# EAGLE design RH028.1 (EAGLE 7.1.0)
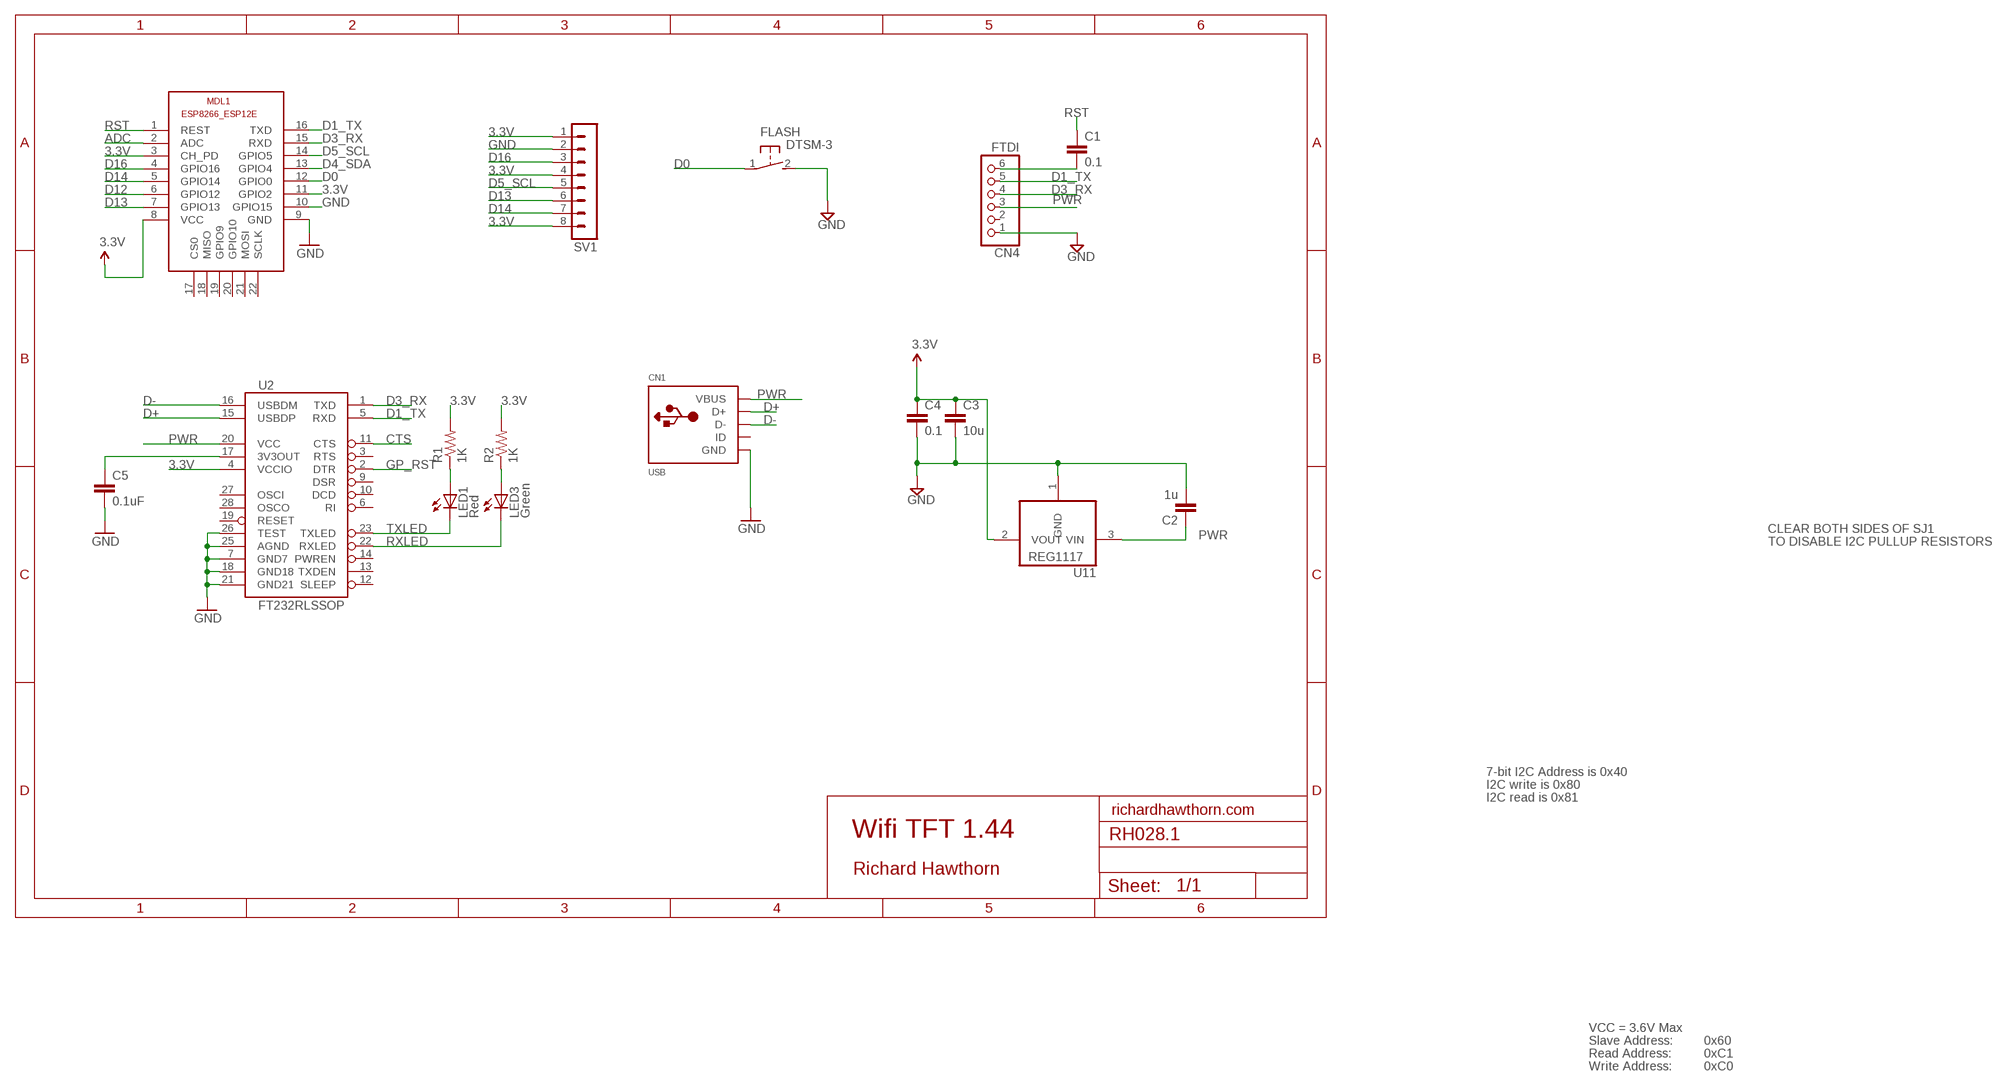
[diagram p0: schematic, sheet 1]

## Parts
C1  0.1  CAP0603-CAP  [0603-CAP]
C2  1u  CAP0603-CAP  [0603-CAP]
C3  10u  CAP0805-CAP  [0805-CAP]
C4  0.1  CAP0603-CAP  [0603-CAP]
C5  0.1uF  CAP0402-CAP  [0402-CAP]
CN1  USB  USBMINIB  [USB-MINIB]
CN4  FTDI  PINHD-1X6  [1X06]
FLASH  DTSM-3  [DTSM-3]
LED1  Red  LED0603  [LED-0603]
LED3  Green  LED0603  [LED-0603]
MDL1  ESP8266-12EESP8266-ESP12E  [ESP8266-ESP12E]
R1  1K  RESISTOR0402-RES  [0402-RES]
R2  1K  RESISTOR0402-RES  [0402-RES]
SV1  MA08-1  [MA08-1]
U2  FT232RLSSOP  [SSOP28DB]
U11  REG1117  [SOT223]

## Nets
3.3V: C3.1 C4.1 MDL1.3(CH_PD) MDL1.8(VCC) MDL1.11(GPIO2) R1.2 R2.2 SV1.1 SV1.4 SV1.8 U2.4(VCCIO) U11.2(VOUT)
3.3VOUT: C5.1 U2.17(3V3OUT)
ADC: MDL1.2(ADC)
CTS: U2.11(CTS)
D0: FLASH.1 MDL1.12(GPIO0)
D1_TX: CN4.5 MDL1.16(TXD) U2.5(RXD)
D3_RX: CN4.4 MDL1.15(RXD) U2.1(TXD)
D4_SDA: MDL1.13(GPIO4)
D5_SCL: MDL1.14(GPIO5) SV1.5
D12: MDL1.6(GPIO12)
D13: MDL1.7(GPIO13) SV1.6
D14: MDL1.5(GPIO14) SV1.7
D16: MDL1.4(GPIO16) SV1.3
D+: CN1.D+ U2.15(USBDP)
D-: CN1.D- U2.16(USBDM)
GND [power]: C2.2 C3.2 C4.2 C5.2 CN1.GND CN4.1 FLASH.2 MDL1.9(GND) MDL1.10(GPIO15) SV1.2 U2.7(GND7) U2.18(GND18) U2.21(GND21) U2.25(AGND) U2.26(TEST) U11.1(GND)
GP_RST: U2.2(DTR)
N$2: LED1.A R1.1
N$3: LED3.A R2.1
N$20: C1.2 CN4.6
PWR [power]: C2.1 CN1.VBUS CN4.3 U2.20(VCC) U11.3(VIN)
RST: C1.1 MDL1.1(REST)
RXLED: LED3.C U2.22(RXLED)
TXLED: LED1.C U2.23(TXLED)
Unconnected: CN1.ID CN4.2 MDL1.17(CS0) MDL1.18(MISO) MDL1.19(GPIO9) MDL1.20(GPIO10) MDL1.21(MOSI) MDL1.22(SCLK) U2.3(RTS) U2.6(RI) U2.9(DSR) U2.10(DCD) U2.12(SLEEP) U2.13(TXDEN) U2.14(PWREN) U2.19(RESET) U2.27(OSCI) U2.28(OSCO)

## Notes on the sheet
- CLEAR BOTH SIDES OF SJ1
- TO DISABLE I2C PULLUP RESISTORS
- 7-bit I2C Address is 0x40
- I2C write is 0x80
- I2C read is 0x81
- richardhawthorn.com
- Wifi TFT 1.44
- Richard Hawthorn
- VCC = 3.6V Max
- Slave Address: | 0x60
- Read Address: | 0xC1
- Write Address: | 0xC0

## Library data of the parts
C1-C4 = LowPowerLab:CAP: Capacitor Standard 0603 ceramic capacitor, and 0.1" leaded capacitor.
C5 = SparkFun:CAP: Capacitor Standard 0603 ceramic capacitor, and 0.1" leaded capacitor.
CN1 = LowPowerLab:USB: USB Connectors USBMINIB - Surface Mount Female Mini-B USB Connector 4UConnector: 06564 By microbuilder.eu Thru-hole RA Female Mini-B USB Connector 4UConnector: 18732 By ladyada.net
CN4 = pinhead:PINHD-1X6: PIN HEADER
FLASH = switch-tact:DTSM-3
LED1 LED3 = SparkFun:LED: LEDs Standard schematic elements and footprints for 5mm, 3mm, 1206, and 0603 sized LEDs. 5mm - Spark Fun Electronics SKU : COM-00529 (and others)
MDL1 = ESP8266-ESP12E:ESP8266-12E: ESP8266-12E with additional I/O and GPIO04/05 corrected The author cannot warrant that this library is free from error or will meet your specific requirements. Created by PuceBaboon.com. Komagane, Nagano, JAPAN
R1 R2 = SparkFun:RESISTOR: Resistor Basic schematic elements and footprints for 0603, 1206, and PTH resistors.
SV1 = con-lstb:MA08-1: PIN HEADER; OC_FARNELL: unknown; OC_NEWARK: unknown
U2 = SparkFun:FT232RL: USB UART FT232RL 4th Generation USB UART (USB <-> Serial) Controller. Spark Fun Electronics SKU : COM-00650
U11 = burr-brown:REG1117: 800mA and 1A Low Dropout (LDO) Positive Regulator 1.8V, 2.5V, 2.85V, 3.3V, 5V, and Adj; MPN: REG1117; OC_FARNELL: 1097566; OC_NEWARK: 14P6981

## Net classes
1 power: width 0.381 mm, clearance 0.254 mm

## Board
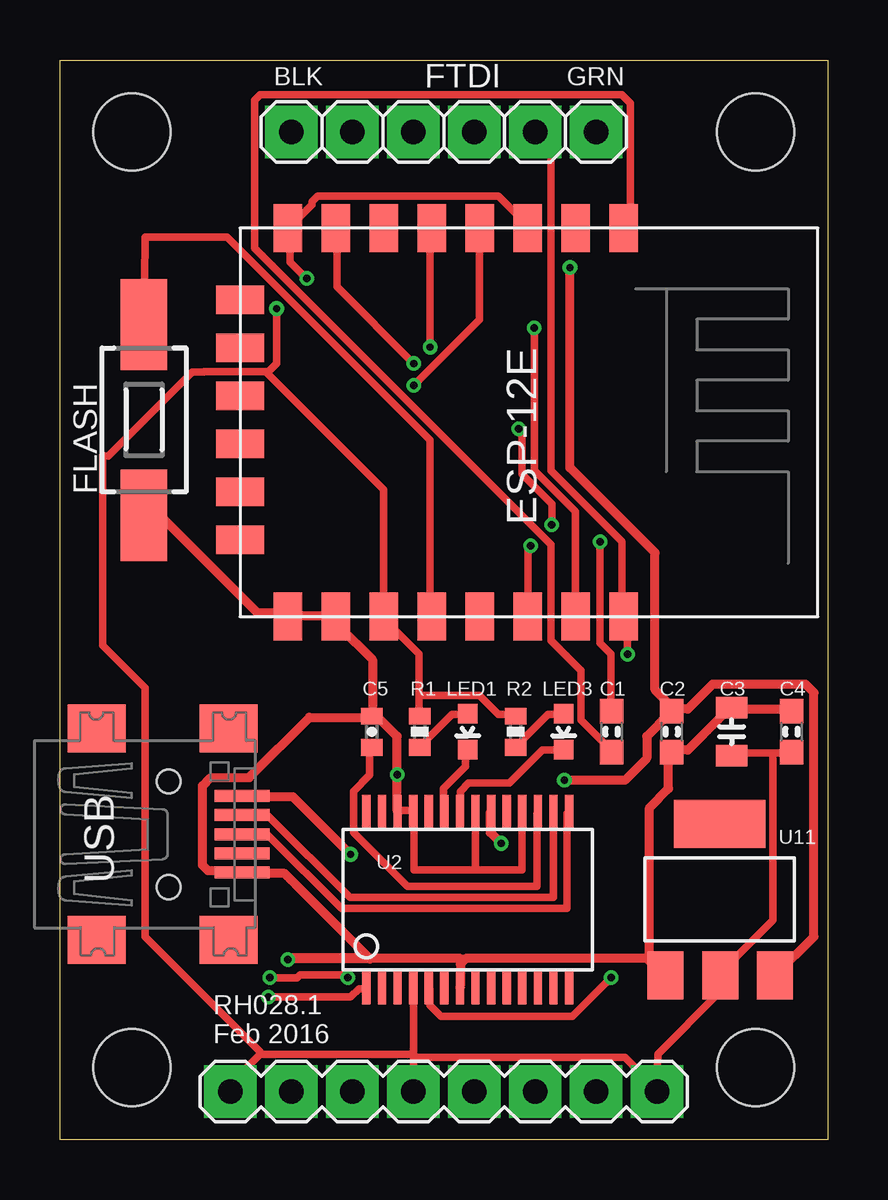
[diagram p1: board, top side]
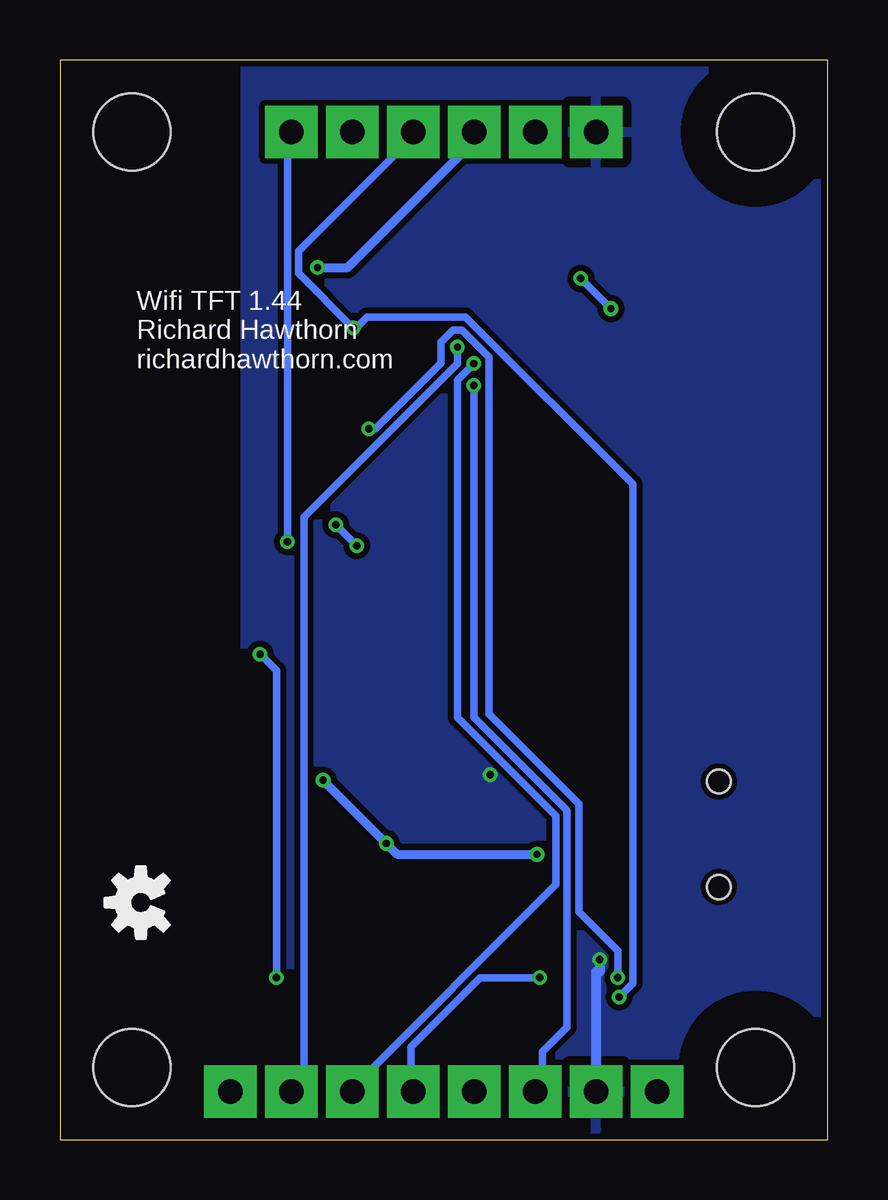
[diagram p2: board, bottom side, seen from below]

Size 32 x 45 mm. Coordinates in mm from the lower left corner, seen from the top.
Outline: 0,0 0,45 32,45 32,0 0,0
Copper layers (1*16): Top 0.035mm / dielectric 1.5mm / Bottom 0.035mm
Design rules "ITEADstudio_DRC *": minimum track width 12mil, minimum drill 12mil, track to track 6mil, track to pad 6mil, pad to pad 6mil, via to via 6mil, smd to smd 0mil, copper to edge 10mil, drill to drill 10mil, minimum pad ring 10mil, minimum via ring 6mil, stop-mask expansion 2mil, vias tented up to drill 100mil, thermal gap 15mil
Holes 3.2 mm at 3,3 29,3 3,42 29,42
tRestrict: area 24.5,19.5 to 32,45
bRestrict: area 24.5,19.5 to 32,45; area 0,0 to 6,6; area 26,0 to 32,6; area 0.1,39.1 to 5.9,44.9

### Footprints (pad centres in the part's own frame; a part is rotated, then mirrored left to right if it is on the bottom)
0603-CAP = smd 1.016 x 0.965: 1 -0.85,0; 2 0.85,0
0805-CAP = smd 0.902 x 1.3: 1 -1,0; 2 1,0
0402-CAP = smd 0.7 x 0.9: 1 -0.65,0; 2 0.65,0
USB-MINIB = smd 0.5 x 2.308: D+ 0,4.064; D- -0.8,4.064; GND 1.6,4.064; ID 0.8,4.064; VBUS -1.6,4.064 | smd 2 x 2.4: GND1 -4.4,-2; GND2 -4.4,3.5; GND3 4.4,3.5; GND4 4.4,-2 | hole 1: -2.2,1; 2.2,1
1X06 = drill 1.016 pad 2.184 square: 1 -6.35,0; 2 -3.81,0; 3 -1.27,0; 4 1.27,0; 5 3.81,0; 6 6.35,0
DTSM-3 = smd 3.81 x 1.93: 1 -3.97,0; 2 3.97,0
LED-0603 = smd 0.8 x 0.8: A 0,-0.75; C 0,0.75
ESP8266-ESP12E = smd 2 x 1.2: 1 0,16; 2 0,14; 3 0,12; 4 0,10; 5 0,8; 6 0,6; 7 0,4; 8 0,2; 9 16.2,2; 10 16.2,4; 11 16.2,6; 12 16.2,8; 13 16.2,10; 14 16.2,12; 15 16.2,14; 16 16.2,16 | smd 1.2 x 2: 17 11,0; 18 3,0; 19 5,0; 20 13,0; 21 7,0; 22 9,0
0402-RES = smd 0.7 x 0.9: 1 -0.65,0; 2 0.65,0
MA08-1 = drill 1.016 pad 2.184 square: 1 -8.89,0; 2 -6.35,0; 3 -3.81,0; 4 -1.27,0; 5 1.27,0; 6 3.81,0; 7 6.35,0; 8 8.89,0
SSOP28DB = smd 0.348 x 1.397: 1 -4.225,-3.656; 2 -3.575,-3.656; 3 -2.925,-3.656; 4 -2.275,-3.656; 5 -1.625,-3.656; 6 -0.975,-3.656; 7 -0.325,-3.656; 8 0.325,-3.656; 9 0.975,-3.656; 10 1.625,-3.656; 11 2.275,-3.656; 12 2.925,-3.656; 13 3.575,-3.656; 14 4.225,-3.656; 15 4.225,3.656; 16 3.575,3.656; 17 2.925,3.656; 18 2.275,3.656; 19 1.625,3.656; 20 0.975,3.656; 21 0.325,3.656; 22 -0.325,3.656; 23 -0.975,3.656; 24 -1.625,3.656; 25 -2.275,3.656; 26 -2.925,3.656; 27 -3.575,3.656; 28 -4.225,3.656
SOT223 = smd 1.499 x 2.007: 1 -2.261,-3.15; 2 0.025,-3.15; 3 2.311,-3.15 | smd 3.81 x 2.007: 4 0,3.15

### Placement (x,y rotation side)
C1  23,17 90 top
C2  25.5,17 270 top
C3  28,17 90 top
C4  30.5,17 90 top
C5  13,17 90 top
CN1  3.53,12.73 270 top
CN4  16,42 0 top
FLASH  3.5,30 270 top
LED1  17,17 180 top
LED3  21,17 180 top
MDL1  7.5,38 270 top
R1  15,17 90 top
R2  19,17 90 top
SV1  16,2 0 top
U2  17,10 0 top
U11  27.5,10 0 top
U$3  [OSHW-LOGO-S]  28.63,9.88 90 bottom

### Tracks (layer width: path | path; a pad name or v marks a point on that pad's centre or on a via)
3.3V  (via drill 0.3)
  Top 0.305: 29.72,16.12 28.12,16.12 C3.1 | 29.72,16.12 30.4,16.12 C4.1 | 29.72,16.12 29.72,9.14 27.55,6.97 U11.2 27.43,6.74 27.43,6.07 24.92,3.56 SV1.8 24.8,2.17 23.55,3.43 14.74,3.43 | MDL1.3 19.55,38.06 18.29,39.32 10.74,39.32 10.52,39.09 10.52,38.98 9.6,38.06 MDL1.8 9.6,37.95 9.6,36.58 v10.29,35.89 | 14.97,18.52 14.97,20.23 13.49,21.72 MDL1.11 13.49,21.95 13.49,27.09 8.63,31.95 | 14.97,18.52 14.97,17.72 R1.2 | 14.97,18.52 17.49,18.52 18.29,17.72 18.97,17.72 R2.2 | 14.74,3.43 14.74,2.06 SV1.4 | 14.74,3.43 14.74,3.54 | 14.74,3.54 14.74,6.29 U2.4 | 8.34,3.54 7.2,2.4 7.2,2.06 SV1.1 | 14.74,3.54 8.34,3.54 | 8.63,31.95 8.57,32 6,32 5.5,32 2,28.5 1.79,28.5 1.79,20.59 3.54,18.83 3.54,8.46 8.34,3.66 8.34,3.54 | v9.03,34.63 9.03,32.35 8.63,31.95
  Bottom 0.305: v9.03,34.63 v10.29,35.89
3.3VOUT
  Top 0.305: C5.1 12.92,16.34 12.92,15.2 12.23,14.52 12.23,12.8 14.49,10.54 19.89,10.54 19.89,13.6 U2.17
D0
  Top 0.305: FLASH.1 3.54,37.6 6.97,37.6 15.43,29.15 15.43,21.83 MDL1.12
D1_TX  (via drill 0.3)
  Top 0.305: CN4.5 19.89,41.95 20.46,41.38 20.46,27.89 23.43,24.92 23.43,21.83 MDL1.16 23.55,21.72 23.66,21.6 v23.66,20.23 | v22.97,6.74 21.37,5.14 15.89,5.14 15.43,5.6 15.43,6.29 U2.5
  Bottom 0.305: v22.97,6.74 22.97,19.55 v23.66,20.23
D3_RX  (via drill 0.3)
  Top 0.305: v19.77,33.83 19.77,27.89 21.49,26.18 21.49,21.83 MDL1.15 | v8.69,5.94 12.12,5.94 12.46,6.29 12.69,6.29 U2.1
  Bottom 0.305: CN4.4 17.37,41.95 17.37,41.72 22.06,37.03 22.06,36.12 v19.77,33.83 19.66,33.83 19.2,34.29 15.09,34.29 8.12,27.32 8.12,6.51 v8.69,5.94
D5_SCL  (via drill 0.3)
  Top 0.305: MDL1.14 19.5,24.75 v19.62,24.75 | v20.5,25.62 20.5,26.5 19.25,27.75 19.25,29.62 v19.12,29.62 | v8.75,6.75 9.88,6.75 10,6.88 11.88,6.88 v12,6.75
  Bottom 0.305: v20.5,25.62 v19.62,24.75 | v19.12,29.62 18.88,29.62 16.12,32.38 16.12,33.25 15.62,33.75 15.25,33.75 14.12,32.62 14.12,17.75 10.38,14 10.38,9.5 8.75,7.88 v8.75,6.75 | v12,6.75 14.5,6.75 17.38,3.88 17.38,2 SV1.5
D13  (via drill 0.3)
  Top 0.305: v14.74,32.35 11.54,35.55 11.54,37.95 MDL1.7
  Bottom 0.305: v14.74,32.35 15.43,31.66 15.43,17.6 11.32,13.49 11.32,10.63 19.89,2.06 SV1.6
D14  (via drill 0.3)
  Top 0.305: v15.43,33.03 15.43,37.95 MDL1.5
  Bottom 0.305: v15.43,33.03 15.43,32.35 21.83,25.95 21.83,2.52 22.29,2.06 SV1.7
D16  (via drill 0.3)
  Top 0.305: v14.74,31.43 17.49,34.18 17.49,37.95 MDL1.4
  Bottom 0.305: v14.74,31.43 14.74,17.6 10.86,13.72 10.86,4.69 11.89,3.66 11.89,2.29 12.12,2.06 SV1.3
D+
  Top 0.305: U2.15 21.14,13.6 21.14,9.63 11.74,9.63 8.69,12.69 7.66,12.69 CN1.D+
D-
  Top 0.305: U2.16 20.57,13.6 20.57,10.09 12.09,10.09 8.69,13.49 7.66,13.49 CN1.D-
GND  (via drill 0.3)
  Top 0.305: 14.17,13.72 14.63,13.72 U2.25 14.75,13.66 14.75,11.25 17.32,11.25 | U2.18 19.25,13.66 19.25,11.25 17.32,11.25 | 17.32,11.25 U2.21
  Top 0.381: C5.2 13.03,17.6 13.26,17.6 14.06,16.8 v14.06,15.2 14.06,13.72 U2.26 14.17,13.72 | FLASH.2 3.54,26.23 3.54,26.63 8.23,21.95 9.37,21.95 MDL1.9 9.6,21.83 11.43,21.83 MDL1.10 11.66,21.72 11.66,21.37 13.03,20 13.03,17.83 C5.2 | C4.2 30.4,17.95 28.12,17.95 C3.2 27.89,17.95 26.18,16.23 25.6,16.23 C2.2 25.38,16 25.38,14.63 24.57,13.83 24.57,7.66 U11.1 25.15,6.86 24.46,7.54 16.92,7.54 16.8,7.43 | 16.8,7.43 16.69,7.32 16.69,6.4 U2.7 | 16.8,7.43 16.69,7.54 12.92,7.54 9.37,11.09 7.66,11.09 CN1.GND 7.43,11.2 6.17,11.2 5.94,11.43 5.94,14.74 6.29,15.09 7.89,15.09 10.4,17.6 12.8,17.6 C5.2
  Top 0.406: 12.92,7.54 9.5,7.54 v9.5,7.5
  Bottom 0.406: v9.5,7.5 9.5,7 9.65,7 SV1.2
  pour Bottom: 0,45 32,45 32,0 0,0
N$2
  Top 0.305: LED1.A 16.92,17.72 16.34,17.72 15.09,16.46 R1.1
N$3
  Top 0.305: LED3.A 20.92,17.72 20.34,17.72 19.09,16.46 R2.1
N$20  (via drill 0.3)
  Top 0.305: v22.52,24.92 22.52,20.69 22.97,20.23 22.97,17.95 C1.2
  Bottom 0.305: v22.52,24.92 22.52,41.83 22.4,41.95 CN4.6
PWR  (via drill 0.3)
  Top 0.381: C2.1 25.6,17.95 26.18,17.95 27.2,18.97 31.09,18.97 31.43,18.63 31.43,8.46 29.83,6.86 U11.3 | v18.4,12.34 17.95,12.8 17.95,13.6 U2.20 | v21.03,14.97 23.55,14.97 24.46,15.89 24.46,16.8 25.38,17.72 C2.1 | v12.12,11.89 9.72,14.29 7.66,14.29 CN1.VBUS | v21.26,36.35 21.26,28 24.8,24.46 24.8,18.75 25.49,18.06 C2.1
  Bottom 0.381: v21.03,14.97 v18.4,12.34 17.95,11.89 v12.12,11.89 | v21.26,36.35 20,36.35 14.74,41.6 14.74,41.95 CN4.3
RST
  Top 0.305: C1.1 22.97,16.23 21.72,17.49 21.72,19.55 20.46,20.8 20.46,24.8 8.12,37.15 8.12,43.32 8.34,43.55 23.43,43.55 23.77,43.2 23.77,38.29 23.55,38.06 MDL1.1
RXLED
  Top 0.305: LED3.C 20.92,16.23 20.12,16.23 18.75,14.86 17.03,14.86 16.69,14.52 16.69,13.72 U2.22
TXLED
  Top 0.305: LED1.C 16.92,16.23 16.92,15.56 15.99,14.63 15.99,13.72 U2.23

### Text on the board
tNames: BLK | FTDI | GRN | RH028.1 / Feb 2016
bNames: Wifi TFT 1.44 / Richard Hawthorn / richardhawthorn.com
tDocu: REG